# Altium schematic sheet OSPLC2_2_IO2.SchDoc
size 294 x 198 mm
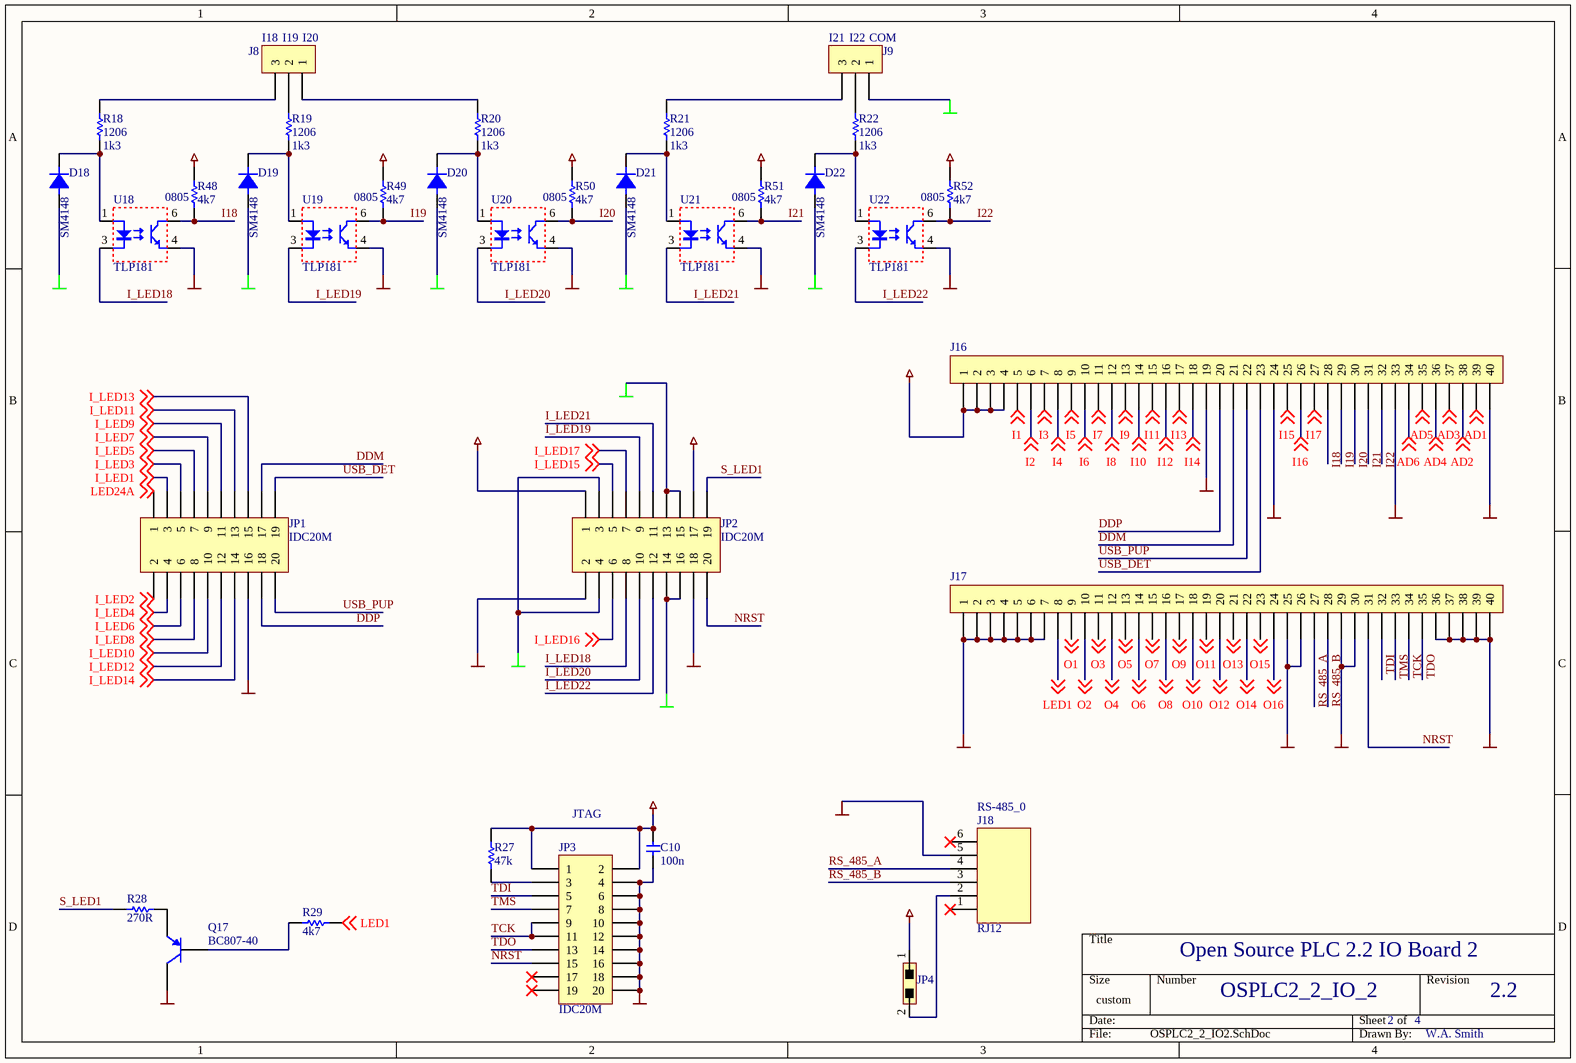
[diagram p0: OSPLC2_2_IO2.SchDoc]

## Parts
C10  value 100n  [0603]  (hidden comment: 0603)
D18  SM4148  [MELF-R2/X1.6]
D19  SM4148  [MELF-R2/X1.6]
D20  SM4148  [MELF-R2/X1.6]
D21  SM4148  [MELF-R2/X1.6]
D22  SM4148  [MELF-R2/X1.6]
J8  PCB TERMINAL  [TERMINAL_3WAY_5MM]  (value not drawn)
J9  PCB TERMINAL  [TERMINAL_3WAY_5MM]  (value not drawn)
J16  HEADER 1 x 40  [HEADER_1_40]  (value not drawn)
J17  HEADER 1 x 40  [HEADER_1_40]  (value not drawn)
J18  RJ12  [RJ-12-95001-2661]
JP1  IDC20M  [IDC_20M_BOX]
JP2  IDC20M  [IDC_20M_BOX]
JP3  IDC20M  [IDC_20M_BOX]
JP4  JUMPER2  [JUMPER2_254]  (value not drawn)
Q17  BC807-40  [SO-G3/Y1]
R18  1206  value 1k3  [1206]
R19  1206  value 1k3  [1206]
R20  1206  value 1k3  [1206]
R21  1206  value 1k3  [1206]
R22  1206  value 1k3  [1206]
R27  value 47k  [0805]  (hidden comment: 0805)
R28  value 270R  [0805]  (hidden comment: 0805)
R29  value 4k7  [0805]  (hidden comment: 0805)
R48  0805  value 4k7  [0805]
R49  0805  value 4k7  [0805]
R50  0805  value 4k7  [0805]
R51  0805  value 4k7  [0805]
R52  0805  value 4k7  [0805]
U18  TLP181  [SOP4_2.54]
U19  TLP181  [SOP4_2.54]
U20  TLP181  [SOP4_2.54]
U21  TLP181  [SOP4_2.54]
U22  TLP181  [SOP4_2.54]

## Nets
GND: C10.2 J16.19 J16.24 J16.33 J16.40 J17.1 J17.2 J17.3 J17.4 J17.5 J17.6 J17.7 J17.25 J17.26 J17.29 J17.30 J17.36 J17.37 J17.38 J17.39 J17.40 J18.5 JP1.16 JP2.2 JP2.18 JP3.4 JP3.6 JP3.8 JP3.10 JP3.12 JP3.14 JP3.16 JP3.18 JP3.20 Q17.3(C) U18.4 U19.4 U20.4 U21.4 U22.4
IN_GND: D18.1(A) D19.1(A) D20.1(A) D21.1(A) D22.1(A) J9.1 JP2.3 JP2.4 JP2.13 JP2.14 JP2.15 JP2.16
VCC3v3: C10.1 J16.1 J16.2 J16.3 J16.4 JP2.1 JP2.17 JP3.1 JP3.2 R27.2 R48.2 R49.2 R50.2 R51.2 R52.2
VCC5: JP4.1
AD1: J16.39 ; off-sheet AD1
AD2: J16.38 ; off-sheet AD2
AD3: J16.37 ; off-sheet AD3
AD4: J16.36 ; off-sheet AD4
AD5: J16.35 ; off-sheet AD5
AD6: J16.34 ; off-sheet AD6
DDM: J16.21 JP1.17
DDP: J16.20 JP1.18
I1: J16.5 ; off-sheet I1
I2: J16.6 ; off-sheet I2
I3: J16.7 ; off-sheet I3
I4: J16.8 ; off-sheet I4
I5: J16.9 ; off-sheet I5
I6: J16.10 ; off-sheet I6
I7: J16.11 ; off-sheet I7
I8: J16.12 ; off-sheet I8
I9: J16.13 ; off-sheet I9
I10: J16.14 ; off-sheet I10
I11: J16.15 ; off-sheet I11
I12: J16.16 ; off-sheet I12
I13: J16.17 ; off-sheet I13
I14: J16.18 ; off-sheet I14
I15: J16.25 ; off-sheet I15
I16: J16.26 ; off-sheet I16
I17: J16.27 ; off-sheet I17
I18: J16.28 R48.1 U18.6
I19: J16.29 R49.1 U19.6
I20: J16.30 R50.1 U20.6
I21: J16.31 R51.1 U21.6
I22: J16.32 R52.1 U22.6
I_LED1: JP1.3 ; off-sheet I_LED1
I_LED2: JP1.2 ; off-sheet I_LED2
I_LED3: JP1.5 ; off-sheet I_LED3
I_LED4: JP1.4 ; off-sheet I_LED4
I_LED5: JP1.7 ; off-sheet I_LED5
I_LED6: JP1.6 ; off-sheet I_LED6
I_LED7: JP1.9 ; off-sheet I_LED7
I_LED8: JP1.8 ; off-sheet I_LED8
I_LED9: JP1.11 ; off-sheet I_LED9
I_LED10: JP1.10 ; off-sheet I_LED10
I_LED11: JP1.13 ; off-sheet I_LED11
I_LED12: JP1.12 ; off-sheet I_LED12
I_LED13: JP1.15 ; off-sheet I_LED13
I_LED14: JP1.14 ; off-sheet I_LED14
I_LED15: JP2.5 ; off-sheet I_LED15
I_LED16: JP2.6 ; off-sheet I_LED16
I_LED17: JP2.7 ; off-sheet I_LED17
I_LED18: JP2.8 U18.3
I_LED19: JP2.9 U19.3
I_LED20: JP2.10 U20.3
I_LED21: JP2.11 U21.3
I_LED22: JP2.12 U22.3
LED1: J17.8 R29.2 ; off-sheet LED1
LED24A: JP1.1 ; off-sheet LED24A
NRST: J17.31 JP2.20 JP3.15
O1: J17.9 ; off-sheet O1
O2: J17.10 ; off-sheet O2
O3: J17.11 ; off-sheet O3
O4: J17.12 ; off-sheet O4
O5: J17.13 ; off-sheet O5
O6: J17.14 ; off-sheet O6
O7: J17.15 ; off-sheet O7
O8: J17.16 ; off-sheet O8
O9: J17.17 ; off-sheet O9
O10: J17.18 ; off-sheet O10
O11: J17.19 ; off-sheet O11
O12: J17.20 ; off-sheet O12
O13: J17.21 ; off-sheet O13
O14: J17.22 ; off-sheet O14
O15: J17.23 ; off-sheet O15
O16: J17.24 ; off-sheet O16
RS_485_A: J17.27 J18.4
RS_485_B: J17.28 J18.3
S_LED1: JP2.19 R28.1
TCK: J17.34 JP3.9 JP3.11
TDI: J17.32 JP3.5
TDO: J17.35 JP3.13
TMS: J17.33 JP3.7
USB_DET: J16.23 JP1.19
USB_PUP: J16.22 JP1.20
NetD18_2: D18.2(C) R18.1 U18.1
NetD19_2: D19.2(C) R19.1 U19.1
NetD20_2: D20.2(C) R20.1 U20.1
NetD21_2: D21.2(C) R21.1 U21.1
NetD22_2: D22.2(C) R22.1 U22.1
NetJ8_1: J8.1 R20.2
NetJ8_2: J8.2 R19.2
NetJ8_3: J8.3 R18.2
NetJ9_2: J9.2 R22.2
NetJ9_3: J9.3 R21.2
NetJ18_2: J18.2 JP4.2
NetJP3_3: JP3.3 R27.1
NetQ17_1: Q17.1(B) R29.1
NetQ17_2: Q17.2(E) R28.2

Not connected (* = marked no-connect by the designer): J18 1* 6*; JP3 17* 19*

## Notes on the sheet
- (near J8) I18
- (near J8) I19
- (near J8) I20
- (near J9) I21
- (near J9) I22
- (near J9) COM
- JTAG
- (near J18) RS-485_0
- Open Source PLC 2.2 IO Board 2
- OSPLC2_2_IO_2
- 2.2
- 2
- 4
- W.A. Smith

## Library data of the parts
C10 = CAP_0603: 0603 footprint non-polorised capacitor
D18-D22 = SM4148: SMT 1N4148 diode; Value: SM4148
J8 J9 = TERMINAL_3WAY_5MM: 5mm spaced PCB terminal, 3 pole
J16 J17 = HEADER_1_40: 2.54mm header, 1 by 40; Value: HEADER_1_40_2.54
J18 = RJ-12-95001-2661: RJ 12 Socket, Molex Part num. 95001-2661; Value: RJ12-95001-2661
JP1-JP3 = IDC_20M: 20 pin IDC male connector, vertical, box
JP4 = JUMPER2: 2 Pin Jumper, 2.54mm
Q17 = BC807-40: PNP General Purpose Amplifier; Manufacturer: Fairchild Semiconductor; Revision 1: 11-July-2000: SIM Model Added.; Revision 2: July-2002: Re-released for DXP Platform.; Package Information: Latest Revision: Sep-1998; Class I: Discrete; Class II: BJT - Low Power; Published: 8-Jun-2000; Datasheet: Latest Revision: 1997; Package Reference: SOT-23A; Publisher: Altium Limited
R18-R22 = RES_1206: 1206 footprint resistor
R27-R29 R48-R52 = RES_0805: 0805 footprint resistor
U18-U22 = TLP181: Toshiba Photocoupler; Value: TLP181